# Altium schematic sheet cSLIM-SA_uSD.SchDoc: cSLIM v1 - uSD
size A4; SheetNumber: 8; SheetTotal: 12
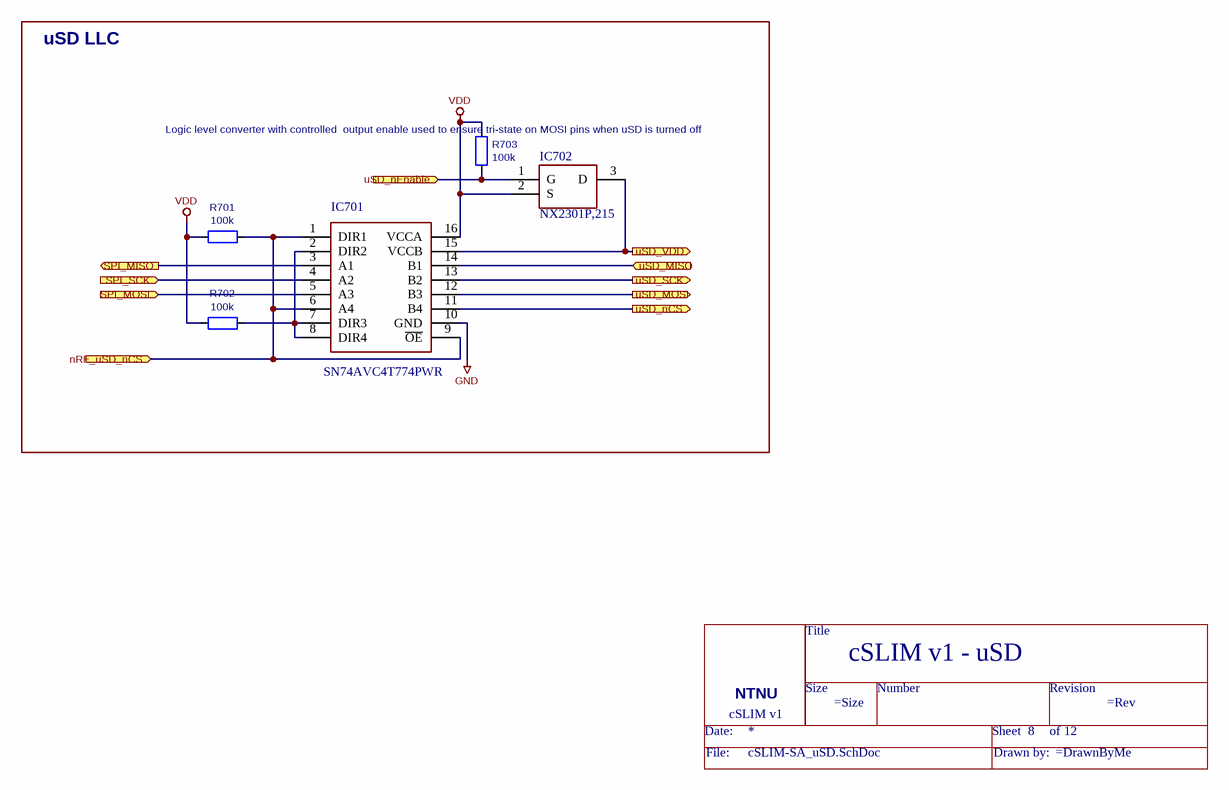
[diagram p0: cSLIM-SA_uSD.SchDoc]

## Parts
=DocumentName  Title_block  (value not drawn)  (no BOM)
IC701  SN74AVC4T774PWR  [SOP65P640X120-16N]
IC702  NX2301P,215  [SOT95P230X110-3N]
R701  100k  [RESC1608X55N]
R702  100k  [RESC1608X55N]
R703  100k  [RESC1608X55N]

## Blocks framed on the sheet
uSD LLC: IC701 IC702 R701-R703

## Ports
nRF_uSD_nCS (in), SPI_MISO (out), SPI_MOSI (in), SPI_SCK (in), uSD_MISO (in), uSD_MOSI (out), uSD_nCS (out), uSD_nEnable (in), uSD_SCK (out), uSD_VDD (out)

## Nets
GND: IC701.10(GND)
VDD: IC701.16(VCCA) IC702.2(S) R701.2 R702.2 R703.2
nRF_uSD_nCS: IC701.1(DIR1) IC701.6(A4) IC701.9(~{OE}) R701.1 ; port nRF_uSD_nCS
SPI_MISO: IC701.3(A1) ; port SPI_MISO
SPI_MOSI: IC701.5(A3) ; port SPI_MOSI
SPI_SCK: IC701.4(A2) ; port SPI_SCK
uSD_MISO: IC701.14(B1) ; port uSD_MISO
uSD_MOSI: IC701.12(B3) ; port uSD_MOSI
uSD_nCS: IC701.11(B4) ; port uSD_nCS
uSD_nEnable: IC702.1(G) R703.1 ; port uSD_nEnable
uSD_SCK: IC701.13(B2) ; port uSD_SCK
uSD_VDD: IC701.15(VCCB) IC702.3(D) ; port uSD_VDD
NetIC701_2: IC701.2(DIR2) IC701.7(DIR3) IC701.8(DIR4) R702.1

## Notes on the sheet
- (near R703) Logic level converter with controlled
  output enable used to ensure tri-state
  on MOSI pins when uSD is turned off
- 1
- 2
- 3
- 4
- 5
- 6
- A
- B
- C
- Eivind Jølsgard
- D
- Title: cSLIM uSD
- File: cSLIM_uSD.sch
- Sheet: /
- NTNU
- KiCad E.D.A.  kicad (5.1.4)-1
- Size: A4
- Date: 2021-03-31
- Rev: v1
- Id: 7/11
- (in symbol Title_block) Title; Size; Number; Revision; NTNU; cSLIM v1; Date:; Sheet; of; File:; Drawn by:

## Library data of the parts
IC701 = SN74AVC4T774PWR: Integrated Circuit; Manufacturer_Name: Texas Instruments; Datasheet Link: http://www.ti.com/lit/gpn/sn74avc4t774; Height: 1.2mm; Manufacturer_Part_Number: SN74AVC4T774PWR; Mouser Part Number: 595-SN74AVC4T774PWR; Mouser Price/Stock: https://www.mouser.co.uk/ProductDetail/Texas-Instruments/SN74AVC4T774PWR?qs=WxL8HmPi5r562Eu%2F2kE2LA%3D%3D; Arrow Part Number: SN74AVC4T774PWR; Arrow Price/Stock: https://www.arrow.com/en/products/sn74avc4t774pwr/texas-instruments?region=nac
IC702 = NX2301P,215: Integrated Circuit; Manufacturer_Name: Nexperia; Datasheet Link: http://www.nxp.com/documents/data_sheet/NX2301P.pdf; Height: 1.1mm; Manufacturer_Part_Number: NX2301P,215; Mouser Part Number: 771-NX2301P215; Mouser Price/Stock: https://www.mouser.co.uk/ProductDetail/Nexperia/NX2301P215?qs=A1cBxND5mHKs%252BLrxCDENxw%3D%3D; Arrow Part Number: NX2301P,215; Arrow Price/Stock: https://www.arrow.com/en/products/nx2301p215/nexperia
R701-R703 = R: Value: 100k